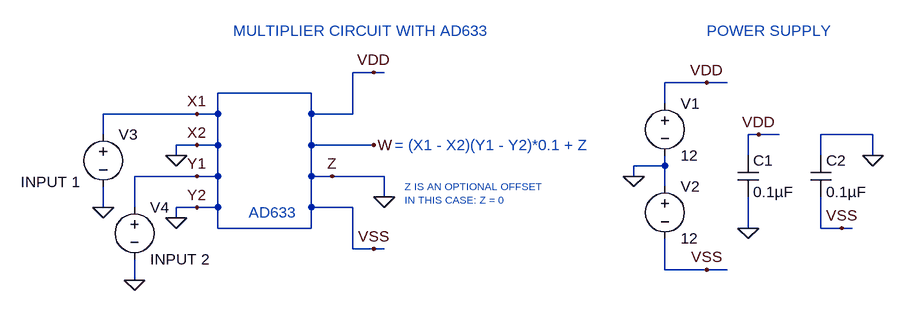
[diagram p0: schematic AD633.asc]
AD633.asc, the LTspice schematic file:
Version 4
SHEET 1 932 680
WIRE 48 -16 16 -16
WIRE 64 -16 48 -16
WIRE 560 0 496 0
WIRE 592 0 560 0
WIRE -48 16 -192 16
WIRE 496 32 496 0
WIRE -224 48 -368 48
WIRE -192 48 -192 16
WIRE -192 48 -224 48
WIRE -48 48 -48 16
WIRE 16 48 16 -16
WIRE 16 48 -48 48
WIRE -368 80 -368 48
WIRE 640 80 624 80
WIRE 672 80 640 80
WIRE 816 80 736 80
WIRE -224 96 -256 96
WIRE -192 96 -192 48
WIRE -192 96 -224 96
WIRE -48 96 -48 48
WIRE 48 96 -48 96
WIRE -256 112 -256 96
WIRE 624 112 624 80
WIRE 736 112 736 80
WIRE 816 112 816 80
WIRE 496 128 496 112
WIRE 496 128 448 128
WIRE -224 144 -320 144
WIRE -192 144 -192 96
WIRE -192 144 -224 144
WIRE -48 144 -48 96
WIRE -16 144 -48 144
WIRE 64 144 -16 144
WIRE 448 144 448 128
WIRE 496 160 496 128
WIRE 64 176 64 144
WIRE -368 192 -368 160
WIRE -320 192 -320 144
WIRE -224 192 -256 192
WIRE -192 192 -192 144
WIRE -192 192 -224 192
WIRE -48 192 -48 144
WIRE 16 192 -48 192
WIRE -256 208 -256 192
WIRE -192 224 -192 192
WIRE -48 224 -48 192
WIRE -48 224 -192 224
WIRE 624 224 624 176
WIRE 736 224 736 176
WIRE 768 224 736 224
WIRE 784 224 768 224
WIRE 16 256 16 192
WIRE 48 256 16 256
WIRE 64 256 48 256
WIRE 496 288 496 240
WIRE 560 288 496 288
WIRE 592 288 560 288
WIRE -320 304 -320 272
FLAG 48 -16 VDD
FLAG 560 0 VDD
FLAG 48 256 VSS
FLAG 448 144 0
FLAG 64 176 0
FLAG 48 96 W
FLAG 560 288 VSS
FLAG 624 224 0
FLAG 816 112 0
FLAG 640 80 VDD
FLAG 768 224 VSS
FLAG -256 112 0
FLAG -256 208 0
FLAG -224 96 X2
FLAG -224 192 Y2
FLAG -16 144 Z
FLAG -224 48 X1
FLAG -224 144 Y1
FLAG -368 192 0
FLAG -320 304 0
SYMBOL voltage 496 16 R0
WINDOW 123 0 0 Left 0
WINDOW 39 0 0 Left 0
SYMATTR InstName V1
SYMATTR Value 12
SYMBOL voltage 496 144 R0
WINDOW 123 0 0 Left 0
WINDOW 39 0 0 Left 0
SYMATTR InstName V2
SYMATTR Value 12
SYMBOL cap 608 112 R0
SYMATTR InstName C1
SYMATTR Value 0.1µF
SYMBOL cap 720 112 R0
SYMATTR InstName C2
SYMATTR Value 0.1µF
SYMBOL voltage -368 64 R0
WINDOW 3 -127 89 Left 2
WINDOW 123 0 0 Left 0
WINDOW 39 0 0 Left 0
SYMATTR InstName V3
SYMATTR Value INPUT 1
SYMBOL voltage -320 176 R0
WINDOW 123 0 0 Left 0
WINDOW 39 0 0 Left 0
SYMATTR InstName V4
SYMATTR Value INPUT 2
TEXT -144 200 Left 2 ;AD633
TEXT 80 96 Left 2 ;= (X1 - X2)(Y1 - Y2)*0.1 + Z
TEXT 560 -80 Left 2 ;POWER SUPPLY
TEXT -168 -80 Left 2 ;MULTIPLIER CIRCUIT WITH AD633
TEXT 96 160 Left 1 ;Z IS AN OPTIONAL OFFSET\nIN THIS CASE: Z = 0

The netlist it stands for:
* AD633.asc
V1 0 0 12
V2 0 0 12
C1 0 0 0.1µF
C2 0 0 0.1µF
V3 0 0 INPUT 1
V4 0 0 INPUT 2
* AD633
* = (X1 - X2)(Y1 - Y2)*0.1 + Z
* POWER SUPPLY
* MULTIPLIER CIRCUIT WITH AD633
* Z IS AN OPTIONAL OFFSET
* IN THIS CASE: Z = 0
.backanno
.end